# Altium schematic sheet Optical_TX.SchDoc
size A4; Author: T. Kreppel; CompanyName: Technische Universität München; Organization: TUM EAL; Address1: Arcisstraße 21; Address2: 80333 München; Address3: GERMANY; SheetNumber: 2; SheetTotal: 2; CompanyName2: Lehrstuhl für Elektrische Antriebsrechnik u. Leistungselektronik
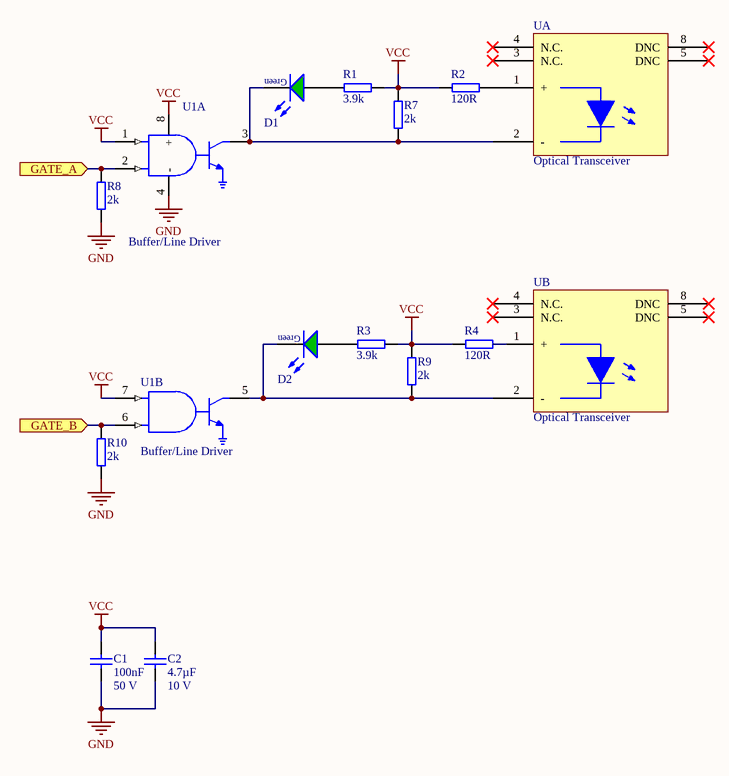
[diagram p0: Optical_TX.SchDoc]

## Parts
C1  Voltage: 50 V  [C_0603(1608)100_L]  (hidden comment: 100nF)
C2  Rated Voltage: 10 V  [CAP_2012X06N]  (hidden comment: 4.7µF)
D1  150060GS75000  [WL-SMCW_0603]  (value not drawn)
D2  150060GS75000  [WL-SMCW_0603]  (value not drawn)
R1  3.9k  [R_0603_N]
R2  120R  [RES_2012X06N]
R3  3.9k  [R_0603_N]
R4  120R  [RES_2012X06N]
R7  2k  [R_0603_N]
R8  2k  [R_0603_N]
R9  2k  [R_0603_N]
R10  2k  [R_0603_N]
U1  Buffer/Line Driver  [SOIC127P600X175-8N]  (parts A,B of 2)
UA  Optical Transceiver  [HFBRx5XX]
UB  Optical Transceiver  [HFBRx5XX]

## Ports
GATE_A (in), GATE_B (in)

## Nets
GND: C1.2 C2.2 R8.1 R10.1 U1.4(-)
VCC: C1.1 C2.1 R1.2 R2.1 R3.1 R4.1 R7.2 R9.2 U1.1(1A) U1.7(2B) U1.8(+)
GATE_A: R8.2 U1.2(1B) ; port GATE_A
GATE_B: R10.2 U1.6(2A) ; port GATE_B
NetD1_1: D1.1(K) R7.1 U1.3(1Y) UA.2(-)
NetD1_2: D1.2(A) R1.1
NetD2_1: D2.1(K) R9.1 U1.5(2Y) UB.2(-)
NetD2_2: D2.2(A) R3.2
NetR2_2: R2.2 UA.1(+)
NetR4_2: R4.2 UB.1(+)

Not connected (* = marked no-connect by the designer): UA 3(N.C.)* 4(N.C.)* 5(DNC)* 8(DNC)*; UB 3(N.C.)* 4(N.C.)* 5(DNC)* 8(DNC)*

## Notes on the sheet
- Title
- Size:
- Date:
- A4
- Revision:
- Time:
- Sheet
- of
- Author:
- Project:

## Library data of the parts
C1 = C_0603: CAP 0603 (1608 Metric) SMD; MPN: CC0603MRY5V9BB104; Tolerance: ±20%; Case-Metric: 1608; Dielectric: X5V; MF: Yageo; Case-EIA: 0603; Max Thickness: 1 mm; Technology: SMT; Created: 2018_09_06_AGeiger; Supplier 1: Mouser; Supplier Part Number 1: 603-C0603MRY5V9BB104; Value: 100nF; Package: 0603
C2 = C_0805: CAP 0805 (2012 Metric) SMD; MPN: LMF212B7475KGHT; Tolerance: ±10%; Case-Metric: 2012; Dielectric: X7R; MF: Taiyo Yuden; Case-EIA: 0805; Max Thickness: 1 mm; Technology: SMT; Created: 2018_09_06_AGeiger; Supplier 1: Mouser; Supplier Part Number 1: 963-LMF212B7475KGHT; Value: 4.7µF
D1 D2 = LED_Green_0603: WL-SMCW SMD Mono-color Chip LED Waterclear, size 0603, Green, 3.2 V, 140°; Forward Voltage: 3.2 V; Luminous Intensity: 430 mcd; Peak Wavelength: 515 nm; Dominant Wavelength: 520 nm; MF: Wuerth Elektronik; Published Date: Sep. 2017; ComponentLink1Description: Manufacturer; ComponentLink1URL: http://www.we-online.de; ComponentLink2Description: Datasheet; ComponentLink2URL: http://katalog.we-online.com/led/datasheet/150060GS75000.pdf; MPN: 150060GS75000; Size: 0603; Viewing Angle: 140°; Emitting Color: Green; Value: 150060GS75000; Package: 0603; Created: 2018_09_06_AGeiger; Supplier 1: Farnell; Supplier Part Number 1: 2322070; Supplier 2: Mouser; Supplier Part Number 2: 710-150060GS75000; Supplier 3: Digi-Key; Supplier Part Number 3: 732-4971-1-ND
R1 R3 = R_0603: SMD Resistor 0603; MPN: CR0603-FX-3901ELF; Tolerance: 1%; Voltage: 75V; Power: 100 mW; MF: Bourns; Package: 0603; Value: 3.9k; Created: 2018_09_06_AGeiger; Supplier 1: Mouser; Supplier Part Number 1: 652-CR0603-FX3901ELF
R2 R4 = R_0805: SMD Resistor 0805; MPN: CR0805-FX-1200ELF; Case_EIA: 0805; MF: Bourns; Voltage: 150 V; Power: 125 mW; Tolerance: 1%; Value: 120R; Supplier 1: Mouser; Supplier Part Number 1: 652-CR0805FX-1200ELF*
R7-R10 = R_0603: SMD Resistor 0603; MPN: RC0603FR-072KL; Tolerance: 1%; Voltage: 75 V; Power: 100 mW; MF: Yageo; Package: 0603; Value: 2k; Created: 2018_09_06_AGeiger; Supplier 1: Mouser; Supplier Part Number 1: 603-RC0603FR-072KL
U1 = SN75452BDR: Buffers & Line Drivers Dual Very-HS HC Peripheral Drivers; MF: Texas Instruments; Supply Voltage: 4.75-5.25 V; Created: 2019_04_09_Kreppel; MPN: SN75452BDR; Package: SOIC-8; Supplier 1: Mouser; Supplier Part Number 1: 595-SN75452BDR
UA UB = HFBR-1521Z: Fibre Optic Transmitters, Receivers, Transceivers Versatile Link Horiz 5MBd Tx RoHS; MF: Broadcom/Avago; Wavelength: 660 nm; Foreward Current: 60 mA; Supply Voltage: 5V; Created: 2019_04_09_Kreppel; MPN: HFBR-1521Z; Data Rate: 5 MBd; Supplier 1: Mouser; Supplier 2: Digi-Key; Supplier Part Number 1: 630-HFBR-1521Z; Supplier Part Number 2: 516-2043-ND